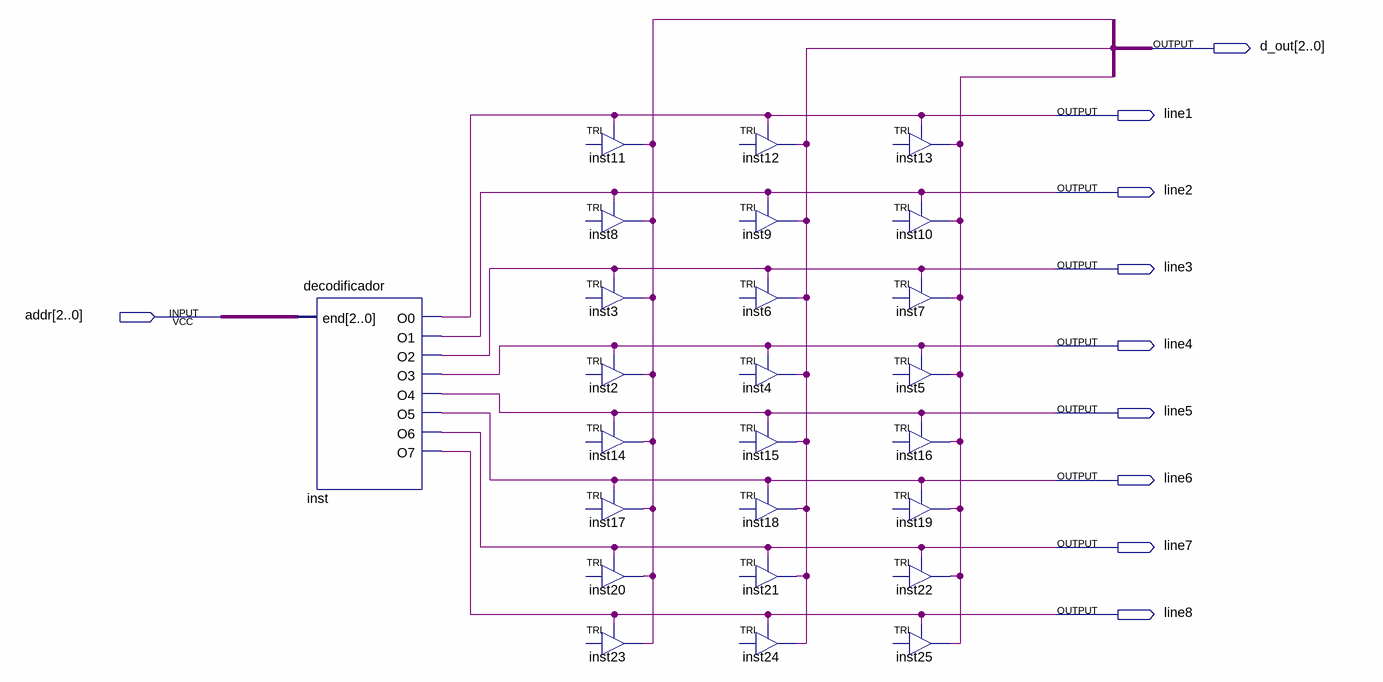
[diagram p0: schematic sheet]
// Quartus schematic rom.bdf as structural Verilog: 25 symbols, 10 pins
module rom (
  input  [2:0] addr,
  output [2:0] d_out,
  output line1,
  output line2,
  output line3,
  output line4,
  output line5,
  output line6,
  output line7,
  output line8
);

  wire inst11_out, inst12_out, inst13_out;

  decodificador inst (
    .\end (addr), .O0(line1), .O1(line2), .O2(line3), .O3(line4), .O4(line5), .O5(line6), .O6(line7),
    .O7(line8));
  TRI inst11 (.OE(line1), .OUT(inst11_out));  // open: IN
  TRI inst8 (.OE(line2), .OUT(inst11_out));  // open: IN
  TRI inst3 (.OE(line3), .OUT(inst11_out));  // open: IN
  TRI inst2 (.OE(line4), .OUT(inst11_out));  // open: IN
  TRI inst14 (.OE(line5), .OUT(inst11_out));  // open: IN
  TRI inst17 (.OE(line6), .OUT(inst11_out));  // open: IN
  TRI inst20 (.OE(line7), .OUT(inst11_out));  // open: IN
  TRI inst23 (.OE(line8), .OUT(inst11_out));  // open: IN
  TRI inst12 (.OE(line1), .OUT(inst12_out));  // open: IN
  TRI inst9 (.OE(line2), .OUT(inst12_out));  // open: IN
  TRI inst6 (.OE(line3), .OUT(inst12_out));  // open: IN
  TRI inst4 (.OE(line4), .OUT(inst12_out));  // open: IN
  TRI inst15 (.OE(line5), .OUT(inst12_out));  // open: IN
  TRI inst18 (.OE(line6), .OUT(inst12_out));  // open: IN
  TRI inst21 (.OE(line7), .OUT(inst12_out));  // open: IN
  TRI inst24 (.OE(line8), .OUT(inst12_out));  // open: IN
  TRI inst13 (.OE(line1), .OUT(inst13_out));  // open: IN
  TRI inst10 (.OE(line2), .OUT(inst13_out));  // open: IN
  TRI inst7 (.OE(line3), .OUT(inst13_out));  // open: IN
  TRI inst5 (.OE(line4), .OUT(inst13_out));  // open: IN
  TRI inst16 (.OE(line5), .OUT(inst13_out));  // open: IN
  TRI inst19 (.OE(line6), .OUT(inst13_out));  // open: IN
  TRI inst22 (.OE(line7), .OUT(inst13_out));  // open: IN
  TRI inst25 (.OE(line8), .OUT(inst13_out));  // open: IN
endmodule
